# Altium schematic sheet TP2_EJ1_CIRCUIT1_PCB.SchDoc
size A4
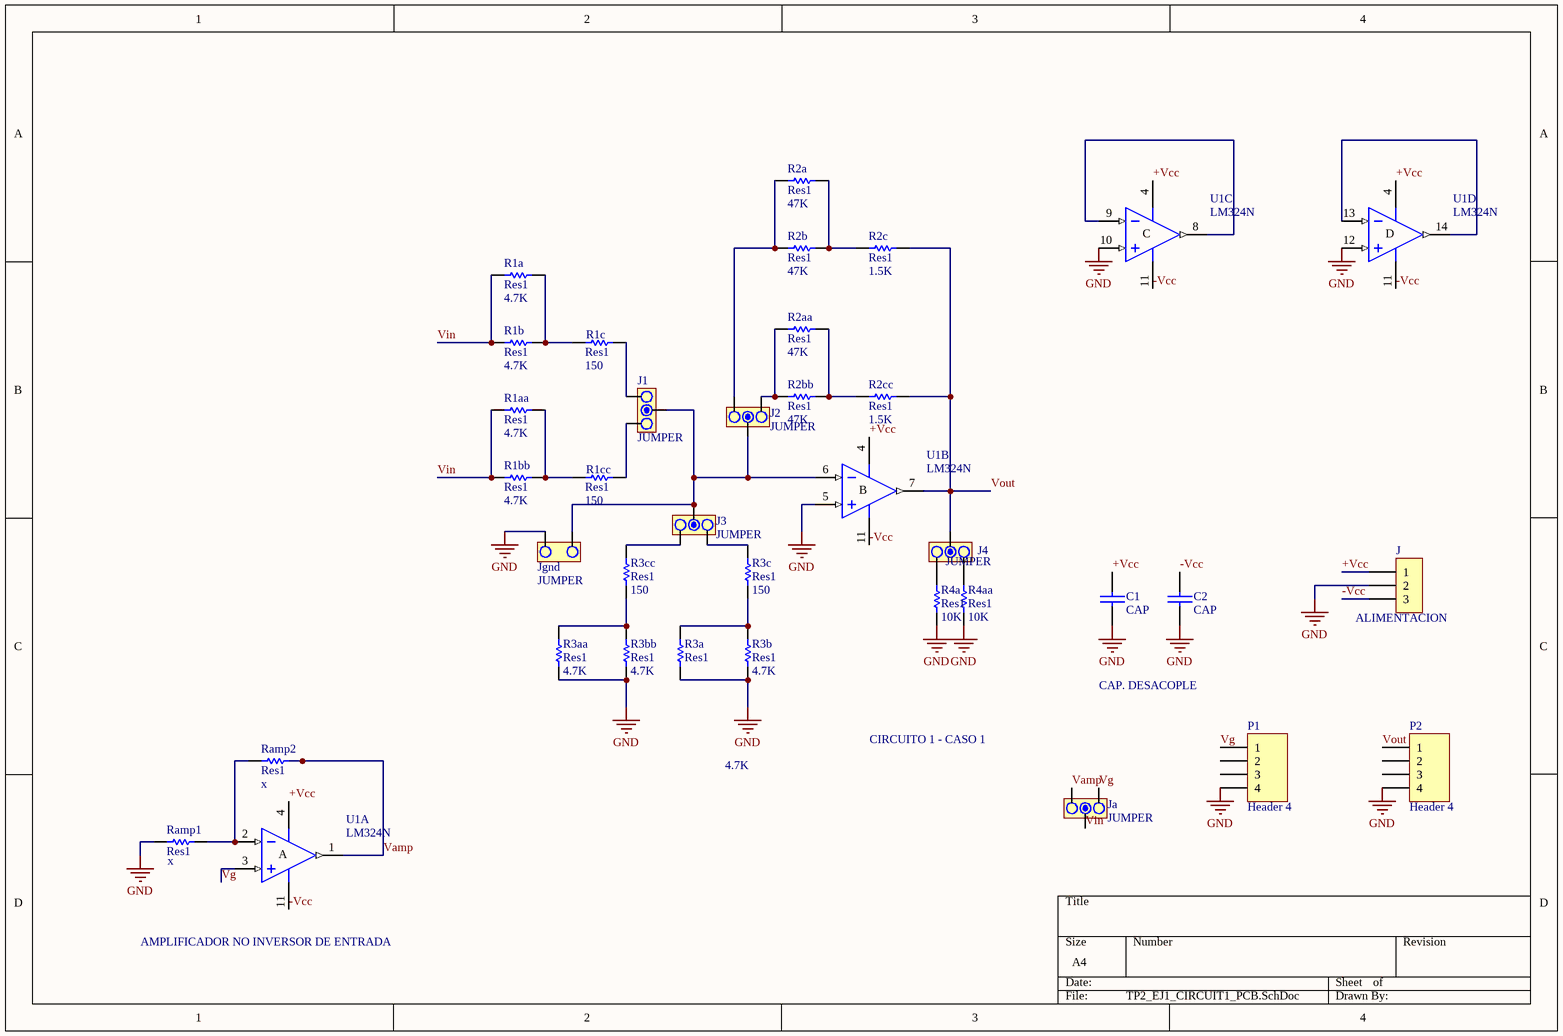
[diagram p0: TP2_EJ1_CIRCUIT1_PCB.SchDoc]

## Parts
C1  CAP  [CAP200]
C2  CAP  [CAP200]
J  ALIMENTACION  [BORNERA3]
J1  JUMPER  [JUMPER3TH]
J2  JUMPER  [JUMPER3TH]
J3  JUMPER  [JUMPER3TH]
J4  JUMPER  [JUMPER3TH]
Ja  JUMPER  [JUMPER3TH]
Jgnd  JUMPER  [JUMPER2]
P1  Header 4  [HDR1X4]
P2  Header 4  [HDR1X4]
R1a  Res1  value 4.7K  [AXIAL-0.3]
R1aa  Res1  value 4.7K  [AXIAL-0.3]
R1b  Res1  value 4.7K  [AXIAL-0.3]
R1bb  Res1  value 4.7K  [AXIAL-0.3]
R1c  Res1  value 150  [AXIAL-0.3]
R1cc  Res1  value 150  [AXIAL-0.3]
R2a  Res1  value 47K  [AXIAL-0.3]
R2aa  Res1  value 47K  [AXIAL-0.3]
R2b  Res1  value 47K  [AXIAL-0.3]
R2bb  Res1  value 47K  [AXIAL-0.3]
R2c  Res1  value 1.5K  [AXIAL-0.3]
R2cc  Res1  value 1.5K  [AXIAL-0.3]
R3a  Res1  value 4.7K  [AXIAL-0.3]
R3aa  Res1  value 4.7K  [AXIAL-0.3]
R3b  Res1  value 4.7K  [AXIAL-0.3]
R3bb  Res1  value 4.7K  [AXIAL-0.3]
R3c  Res1  value 150  [AXIAL-0.3]
R3cc  Res1  value 150  [AXIAL-0.3]
R4a  Res1  value 10K  [AXIAL-0.3]
R4aa  Res1  value 10K  [AXIAL-0.3]
Ramp1  Res1  value x  [AXIAL-0.3]
Ramp2  Res1  value x  [AXIAL-0.3]
U1  LM324N  [N014]  (parts A,B,C,D of 4)

## Nets
GND: C1.2 C2.2 J.2 Jgnd.1 P1.4 P2.4 R3a.1 R3aa.1 R3b.1 R3bb.1 R4a.1 R4aa.1 Ramp1.1 U1.5(IN+) U1.10(IN+) U1.12(IN+)
+Vcc: C1.1 J.1 U1.4(V+)
-Vcc: C2.1 J.3 U1.11(V-)
Vamp: Ja.1 Ramp2.2 U1.1(OUT)
Vg: Ja.3 P1.1 U1.3(IN+)
Vin: Ja.2 R1a.1 R1aa.1 R1b.1 R1bb.1
Vout: J4.2 P2.1 R2c.2 R2cc.2 U1.7(OUT)
NetJ1_1: J1.1 R1cc.2
NetJ1_2: J1.2 J2.2 J3.2 Jgnd.2 U1.6(IN-)
NetJ1_3: J1.3 R1c.2
NetJ2_1: J2.1 R2a.1 R2b.1
NetJ2_3: J2.3 R2aa.1 R2bb.1
NetJ3_1: J3.1 R3c.2
NetJ3_3: J3.3 R3cc.2
NetJ4_1: J4.1 R4aa.2
NetJ4_3: J4.3 R4a.2
NetR1a_2: R1a.2 R1b.2 R1c.1
NetR1aa_2: R1aa.2 R1bb.2 R1cc.1
NetR2a_2: R2a.2 R2b.2 R2c.1
NetR2aa_2: R2aa.2 R2bb.2 R2cc.1
NetR3a_2: R3a.2 R3b.2 R3c.1
NetR3aa_2: R3aa.2 R3bb.2 R3cc.1
NetRamp1_2: Ramp1.2 Ramp2.1 U1.2(IN-)
NetU1_8: U1.8(OUT) U1.9(IN-)
NetU1_13: U1.13(IN-) U1.14(OUT)

Not connected (* = marked no-connect by the designer): P1 2 3; P2 2 3

## Notes on the sheet
- CAP. DESACOPLE
- CIRCUITO 1 - CASO 1
- AMPLIFICADOR NO INVERSOR DE ENTRADA
- (in symbol LM324N, part A) A
- (in symbol LM324N, part B) B
- (in symbol LM324N, part C) C
- (in symbol LM324N, part D) D

## Library data of the parts
J = BORNERA 3
J1-J4 Ja = JUMPER3TH: TIRA DE PINES 1x3
P1 P2 = Header 4: Header, 4-Pin; LatestRevisionDate: 17-Jul-2002; LatestRevisionNote: Re-released for DXP Platform.; Publisher: Altium Limited
R1a R1aa R1b R1bb R1c R1cc R2a R2aa R2b R2bb R2c R2cc R3a R3aa R3b R3bb R3c R3cc R4a R4aa Ramp1 Ramp2 = Res1: Resistor; Published: 8-Jun-2000; LatestRevisionDate: 17-Jul-2002; LatestRevisionNote: Re-released for DXP Platform.; PackageReference: AXIAL-0.3; Publisher: Altium Limited; PackageDescription: Axial Device, Thru-Hole; 2 Leads; 0.3 in Pin Spacing
U1 = LM324N: Quadruple Operational Amplifier; Published: 16-Jan-2001; LatestRevisionDate: 04-Mar-2005; LatestRevisionNote: Stylized 3D Model Added.; DatasheetVersion: Feb-1997; PackageVersion: Oct-1995; PackageReference: N014; Publisher: Altium Limited; PackageDescription: DIP; 14 Leads; Row Spacing 7.62 mm; Pitch 2.54 mm; ComponentLink1Description: Manufacturer Link; ComponentLink1URL: http://www.ti.com/; ComponentLink2Description: Datasheet; ComponentLink2URL: http://www-s.ti.com/sc/ds/lm324.pdf